# EAGLE schematic Arduino_Connexions (EAGLE 9.2.0)
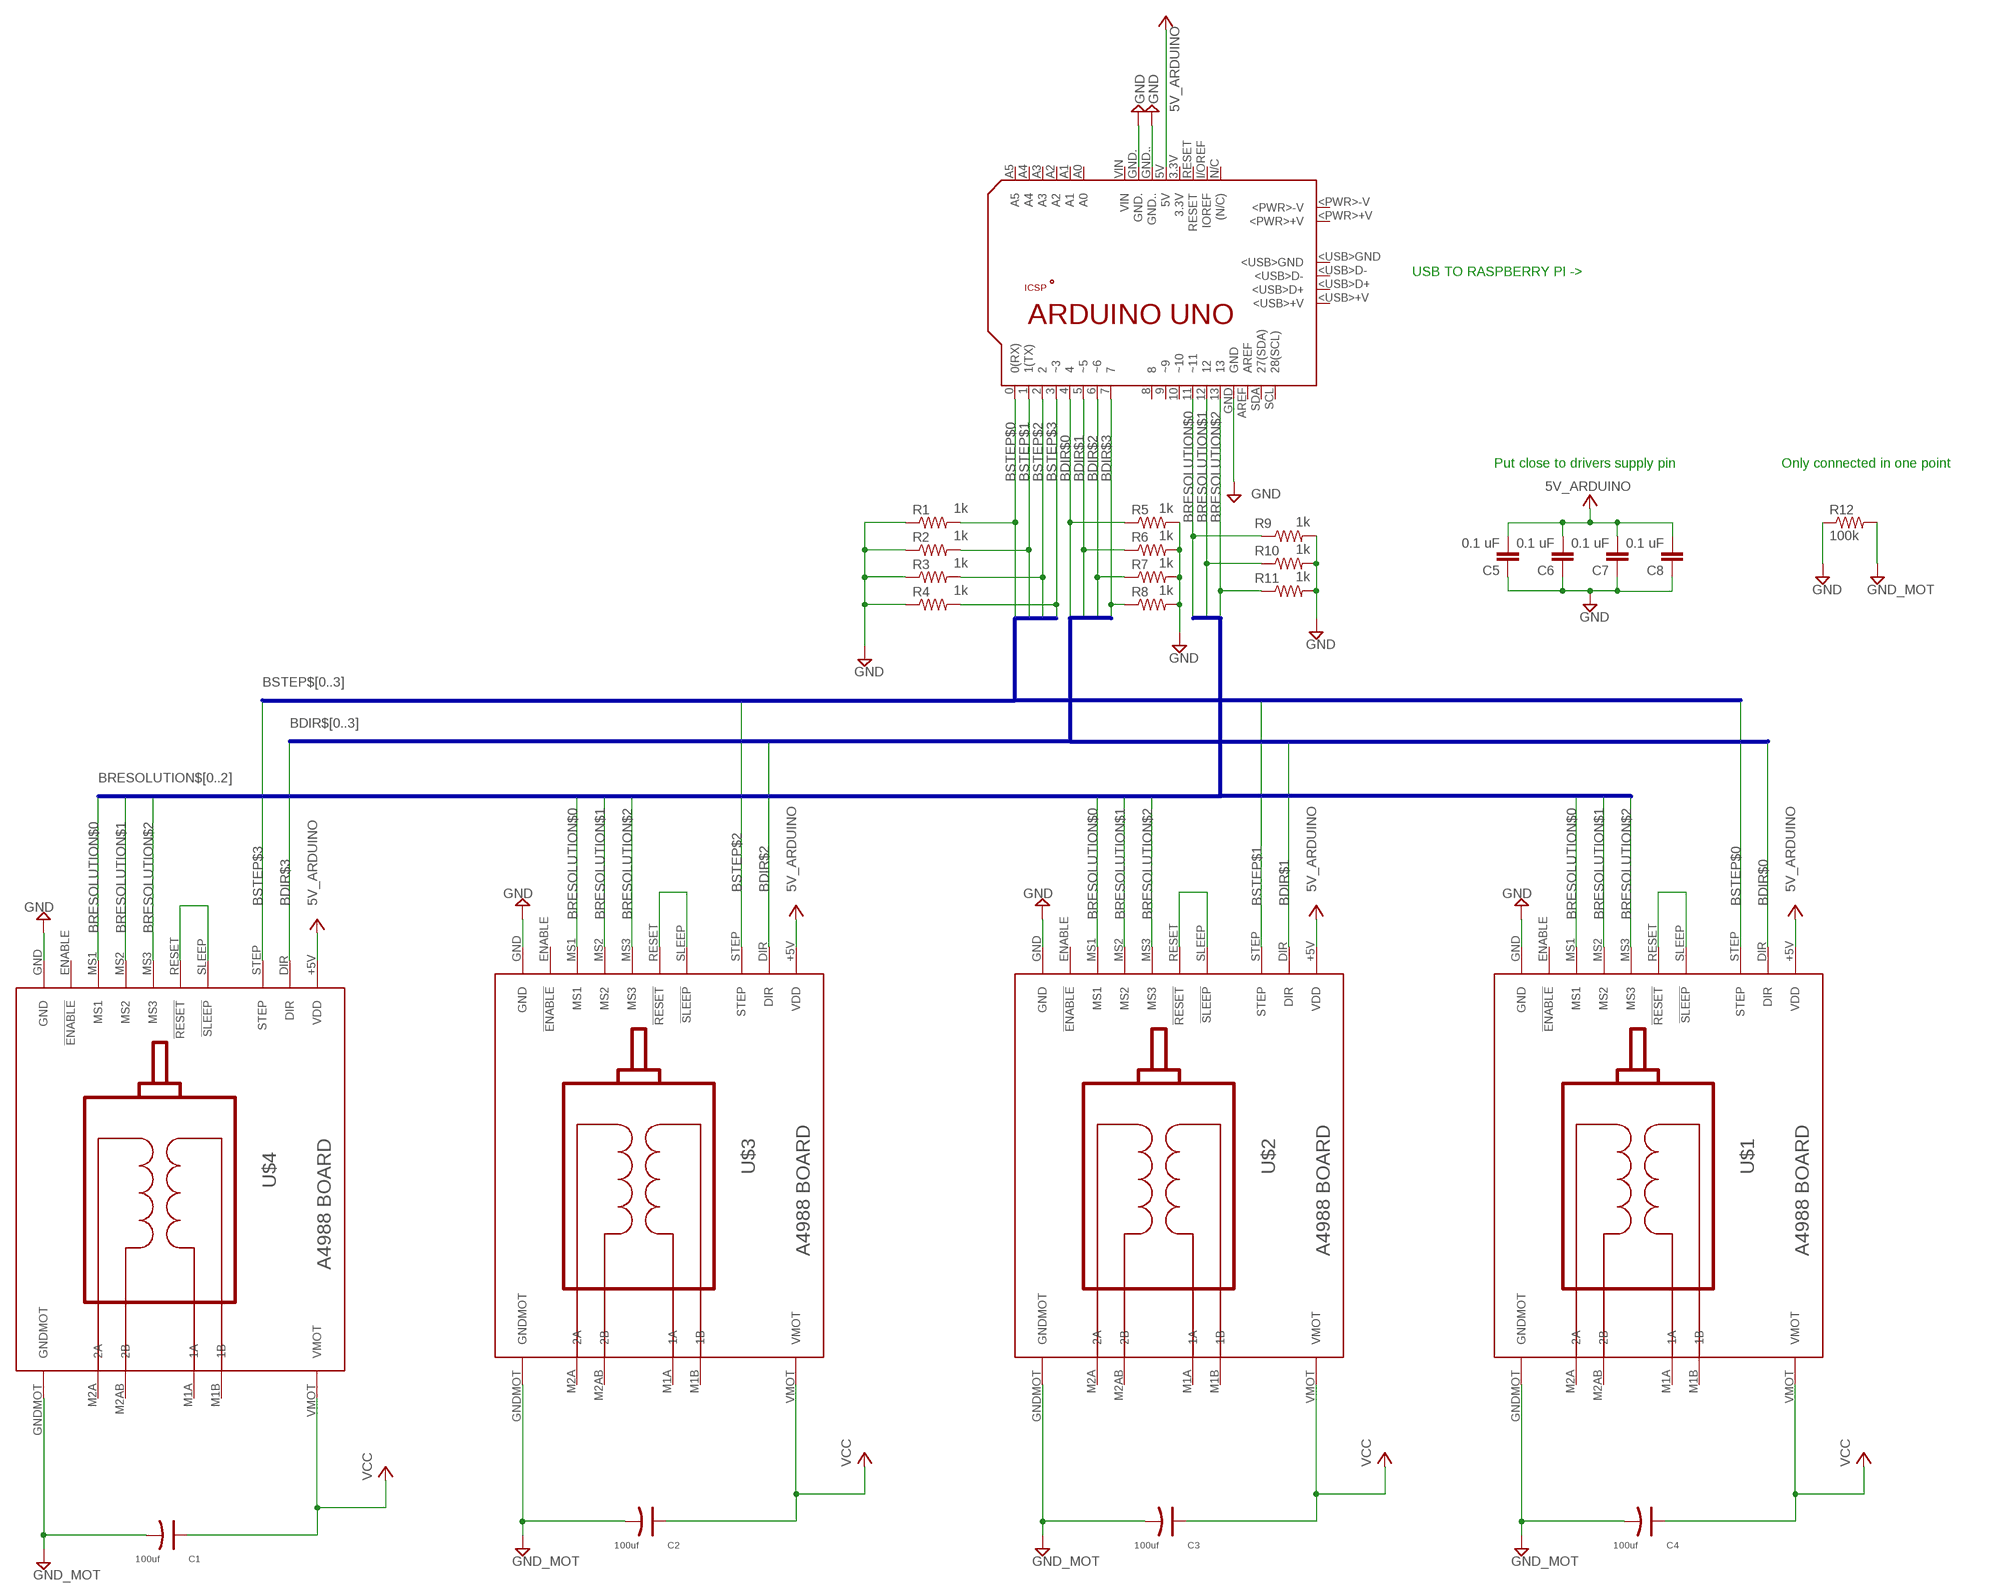
[diagram p0: schematic, sheet 1]

## Parts
C1  100uf  DIP-ALUMINUM-100UF-16V(D5-H7MM)  [PC-D5.3MM]
C2  100uf  DIP-ALUMINUM-100UF-16V(D5-H7MM)  [PC-D5.3MM]
C3  100uf  DIP-ALUMINUM-100UF-16V(D5-H7MM)  [PC-D5.3MM]
C4  100uf  DIP-ALUMINUM-100UF-16V(D5-H7MM)  [PC-D5.3MM]
C5  0.1 uF  C-EU025-024X044  [C025-024X044]
C6  0.1 uF  C-EU025-024X044  [C025-024X044]
C7  0.1 uF  C-EU025-024X044  [C025-024X044]
C8  0.1 uF  C-EU025-024X044  [C025-024X044]
PCB2  ARDUINO_UNO  [ARDUINO_UNO]
R1  1k  R-US_0207/7  [0207/7]
R2  1k  R-US_0207/7  [0207/7]
R3  1k  R-US_0207/7  [0207/7]
R4  1k  R-US_0207/7  [0207/7]
R5  1k  R-US_0207/7  [0207/7]
R6  1k  R-US_0207/7  [0207/7]
R7  1k  R-US_0207/7  [0207/7]
R8  1k  R-US_0207/7  [0207/7]
R9  1k  R-US_0207/7  [0207/7]
R10  1k  R-US_0207/7  [0207/7]
R11  1k  R-US_0207/7  [0207/7]
R12  100k  R-US_0207/7  [0207/7]
U$1  BOARD_A4988  [BOARD_A4988]
U$2  BOARD_A4988  [BOARD_A4988]
U$3  BOARD_A4988  [BOARD_A4988]
U$4  BOARD_A4988  [BOARD_A4988]

## Nets
BDIR$0: PCB2.4 R5.1 U$1.DIR
BDIR$1: PCB2.5(~5) R6.1 U$2.DIR
BDIR$2: PCB2.6(~6) R7.1 U$3.DIR
BDIR$3: PCB2.7 R8.1 U$4.DIR
BRESOLUTION$0: PCB2.11(~11) R9.1 U$1.MS1 U$2.MS1 U$3.MS1 U$4.MS1
BRESOLUTION$1: PCB2.12 R10.1 U$1.MS2 U$2.MS2 U$3.MS2 U$4.MS2
BRESOLUTION$2: PCB2.13 R11.1 U$1.MS3 U$2.MS3 U$3.MS3 U$4.MS3
BSTEP$0: PCB2.0(0(RX)) R1.2 U$1.STEP
BSTEP$1: PCB2.1(1(TX)) R2.2 U$2.STEP
BSTEP$2: PCB2.2 R3.2 U$3.STEP
BSTEP$3: PCB2.3(~3) R4.2 U$4.STEP
GND: C1.- C2.- C3.- C4.- C5.1 C6.1 C7.1 C8.1 PCB2.GND PCB2.GND. PCB2.GND.. R1.1 R2.1 R3.1 R4.1 R5.2 R6.2 R7.2 R8.2 R9.2 R10.2 R11.2 R12.1 R12.2 U$1.GND U$1.GNDMOT U$2.GND U$2.GNDMOT U$3.GND U$3.GNDMOT U$4.GND U$4.GNDMOT ; supply symbol labelled GND_MOT
N$1: U$2.RESET(!RESET) U$2.SLEEP(!SLEEP)
N$2: U$1.RESET(!RESET) U$1.SLEEP(!SLEEP)
N$3: U$3.RESET(!RESET) U$3.SLEEP(!SLEEP)
N$4: U$4.RESET(!RESET) U$4.SLEEP(!SLEEP)
VCC: C1.+ C2.+ C3.+ C4.+ C5.2 C6.2 C7.2 C8.2 PCB2.5V U$1.+5V(VDD) U$1.VMOT U$2.+5V(VDD) U$2.VMOT U$3.+5V(VDD) U$3.VMOT U$4.+5V(VDD) U$4.VMOT ; supply symbol labelled 5V_ARDUINO
Unconnected: PCB2.3.3V PCB2.8 PCB2.9(~9) PCB2.10(~10) PCB2.+5V PCB2.<PWR>+V PCB2.<PWR>-V PCB2.<USB>+V PCB2.<USB>D+ PCB2.<USB>D- PCB2.<USB>GND PCB2.A0 PCB2.A1 PCB2.A2 PCB2.A3 PCB2.A4 PCB2.A5 PCB2.AREF PCB2.GND_ PCB2.I/OREF(IOREF) PCB2.MISO PCB2.MOSI PCB2.N/C((N/C)) PCB2.RESET PCB2.RESET. PCB2.SCK PCB2.SCL(28(SCL)) PCB2.SDA(27(SDA)) PCB2.VIN U$1.ENABLE(!ENABLE) U$1.M1A(1A) U$1.M1B(1B) U$1.M2A(2A) U$1.M2AB(2B) U$2.ENABLE(!ENABLE) U$2.M1A(1A) U$2.M1B(1B) U$2.M2A(2A) U$2.M2AB(2B) U$3.ENABLE(!ENABLE) U$3.M1A(1A) U$3.M1B(1B) U$3.M2A(2A) U$3.M2AB(2B) U$4.ENABLE(!ENABLE) U$4.M1A(1A) U$4.M1B(1B) U$4.M2A(2A) U$4.M2AB(2B)

## Buses
BRESOLUTION$[0..2]
BSTEP$[0..3]
BDIR$[0..3]

## Notes on the sheet
- USB TO RASPBERRY PI ->
- Put close to drivers supply pin | Only connected in one point

## Library data of the parts
C1-C4 = Seeed-Capacitor:DIP-ALUMINUM-100UF-16V(D5-H7MM): 302030031; MPN: KS 100uF/16V
C5-C8 = rcl:C-EU: CAPACITOR, European symbol; SPICEPREFIX: C
PCB2 = E14_Arduino_revC:ARDUINO_UNO: Device for representing an Arduino Uno board with a footprint in an EAGLE design. Created by Dave Young for Element14. More EAGLE documentation at: http://www.element14.com/community/community/knode/cadsoft_eagle
R1-R12 = rcl:R-US_: RESISTOR, American symbol; SPICEPREFIX: R
U$1-U$4 = Clean-Kong:BOARD_A4988